# EAGLE design schem2 (EAGLE 7.5.0)
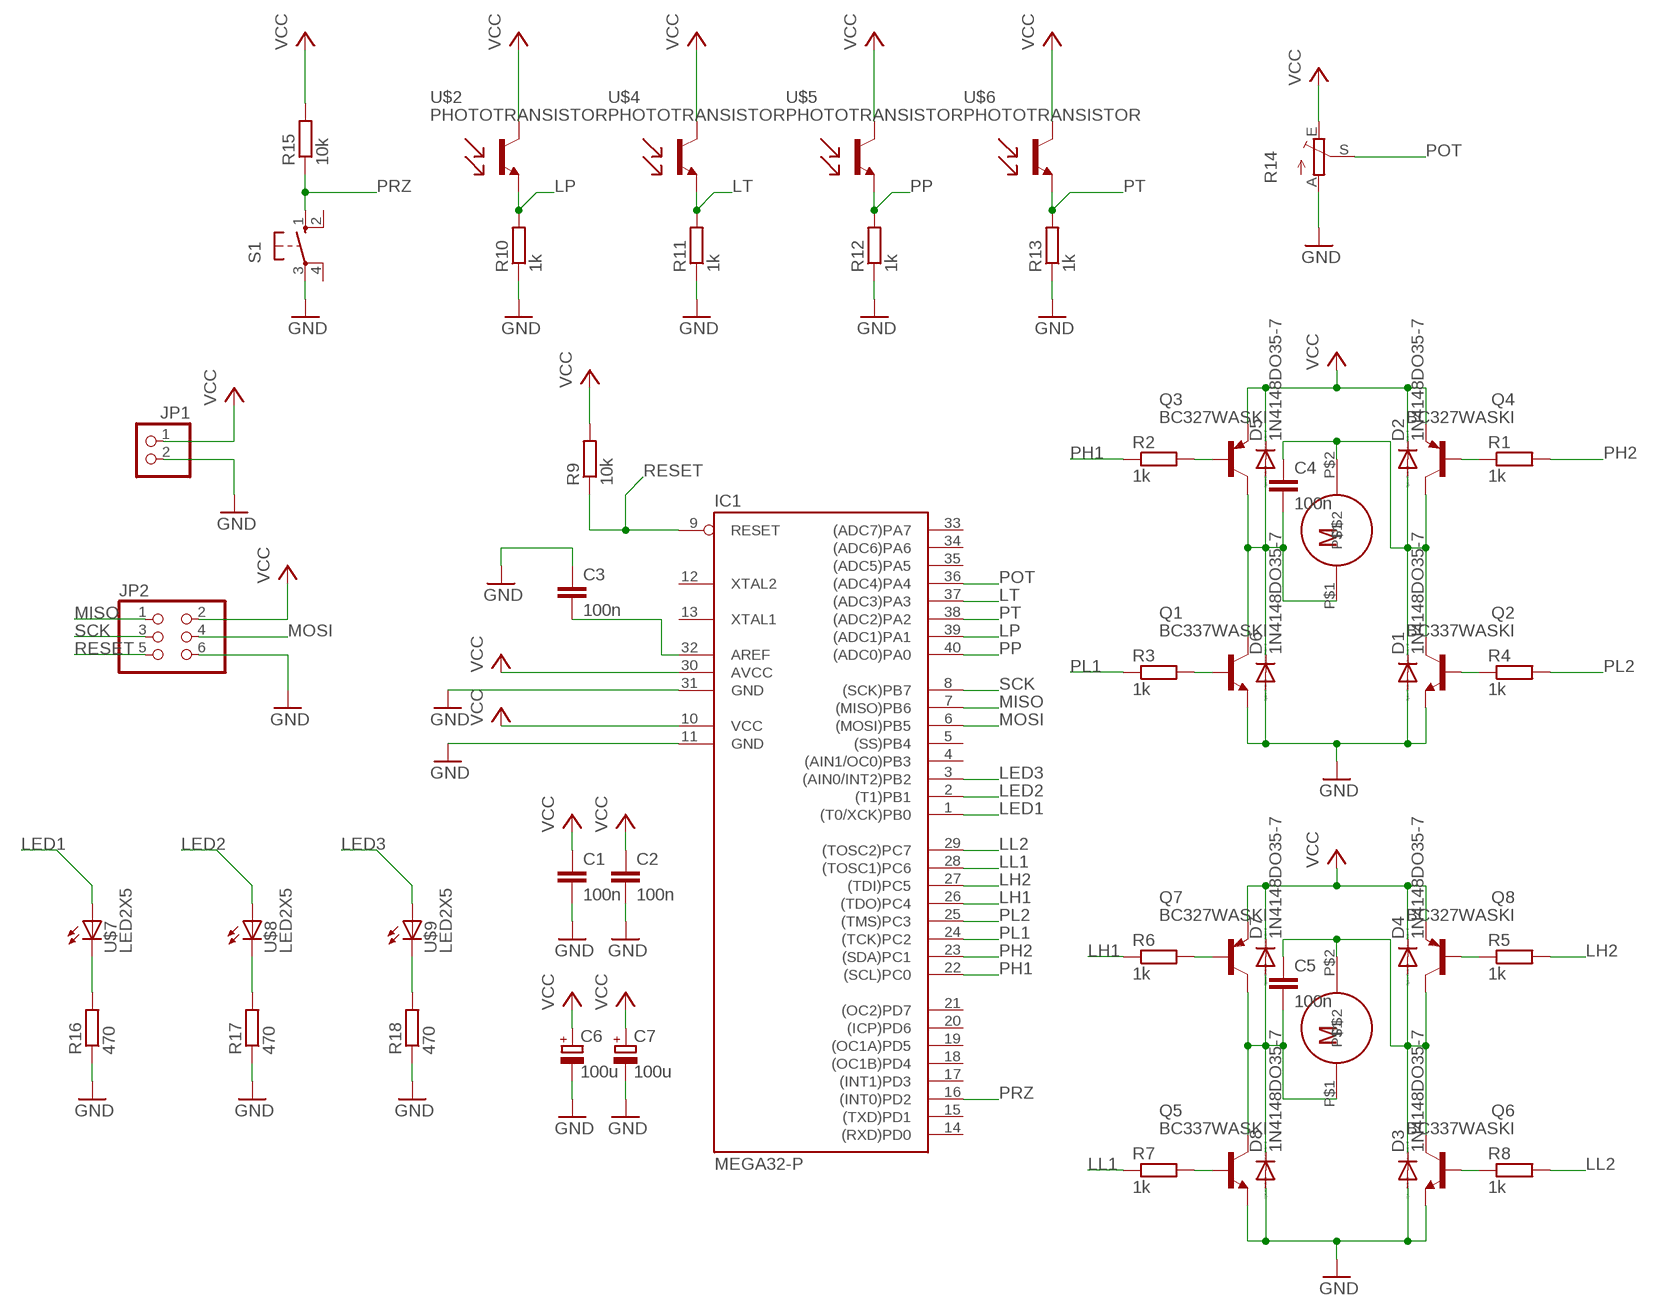
[diagram p0: schematic, sheet 1]

## Parts
C1  100n  C-EU025-025X050  [C025-025X050]
C2  100n  C-EU025-025X050  [C025-025X050]
C3  100n  C-EU025-025X050  [C025-025X050]
C4  100n  C-EU025-025X050  [C025-025X050]
C5  100n  C-EU025-025X050  [C025-025X050]
C6  100u  CPOL-EUE2-5  [E2-5]
C7  100u  CPOL-EUE2-5  [E2-5]
D1  1N4148DO35-7  [DO35-7]
D2  1N4148DO35-7  [DO35-7]
D3  1N4148DO35-7  [DO35-7]
D4  1N4148DO35-7  [DO35-7]
D5  1N4148DO35-7  [DO35-7]
D6  1N4148DO35-7  [DO35-7]
D7  1N4148DO35-7  [DO35-7]
D8  1N4148DO35-7  [DO35-7]
IC1  MEGA32-P  [DIL40]
JP1  PINHD-1X2  [1X02]
JP2  PINHD-2X3  [2X03]
Q1  BC337WASKI  [TO92-WASKI]
Q2  BC337WASKI  [TO92-WASKI]
Q3  BC327WASKI  [TO92-WASKI]
Q4  BC327WASKI  [TO92-WASKI]
Q5  BC337WASKI  [TO92-WASKI]
Q6  BC337WASKI  [TO92-WASKI]
Q7  BC327WASKI  [TO92-WASKI]
Q8  BC327WASKI  [TO92-WASKI]
R1  1k  R-EU_0207/7  [0207/7]
R2  1k  R-EU_0207/7  [0207/7]
R3  1k  R-EU_0207/7  [0207/7]
R4  1k  R-EU_0207/7  [0207/7]
R5  1k  R-EU_0207/7  [0207/7]
R6  1k  R-EU_0207/7  [0207/7]
R7  1k  R-EU_0207/7  [0207/7]
R8  1k  R-EU_0207/7  [0207/7]
R9  10k  R-EU_0207/7  [0207/7]
R10  1k  R-EU_0207/7  [0207/7]
R11  1k  R-EU_0207/7  [0207/7]
R12  1k  R-EU_0207/7  [0207/7]
R13  1k  R-EU_0207/7  [0207/7]
R14  TRIM_EU-B64Y  [B64Y]
R15  10k  R-EU_0207/7  [0207/7]
R16  470  R-EU_0207/7  [0207/7]
R17  470  R-EU_0207/7  [0207/7]
R18  470  R-EU_0207/7  [0207/7]
S1  10-XX  [B3F-10XX]
U$1  DG02S  [DG02S]
U$2  PHOTOTRANSISTOR  [PHOTOTRANSISTOR]
U$3  DG02S  [DG02S]
U$4  PHOTOTRANSISTOR  [PHOTOTRANSISTOR]
U$5  PHOTOTRANSISTOR  [PHOTOTRANSISTOR]
U$6  PHOTOTRANSISTOR  [PHOTOTRANSISTOR]
U$7  LED2X5  [LED3MM]
U$8  LED2X5  [LED3MM]
U$9  LED2X5  [LED3MM]

## Nets
GND: C1.2 C2.2 C3.1 C6.- C7.- D1.A D3.A D6.A D8.A IC1.11(GND) IC1.31(GND) JP1.2 JP2.6 Q1.E Q2.E Q5.E Q6.E R10.1 R11.1 R12.1 R13.1 R14.A R16.1 R17.1 R18.1 S1.3(P)
LED1: IC1.1((T0/XCK)PB0) U$7.A
LED2: IC1.2((T1)PB1) U$8.A
LED3: IC1.3((AIN0/INT2)PB2) U$9.A
LH1: IC1.26((TDO)PC4) R6.1
LH2: IC1.27((TDI)PC5) R5.2
LL1: IC1.28((TOSC1)PC6) R7.1
LL2: IC1.29((TOSC2)PC7) R8.2
LP: IC1.39((ADC1)PA1) R10.2 U$2.E
LT: IC1.37((ADC3)PA3) R11.2 U$4.E
MISO: IC1.7((MISO)PB6) JP2.1
MOSI: IC1.6((MOSI)PB5) JP2.4
N$1: C4.2 D5.A D6.C Q1.C Q3.C U$1.P$1
N$2: C4.1 D1.C D2.A Q2.C Q4.C U$1.P$2
N$3: C5.2 D7.A D8.C Q5.C Q7.C U$3.P$1
N$4: R16.2 U$7.K(C)
N$5: Q7.B R6.2
N$6: Q8.B R5.1
N$7: Q3.B R2.2
N$8: Q4.B R1.1
N$9: Q2.B R4.1
N$10: Q1.B R3.2
N$11: Q6.B R8.1
N$12: Q5.B R7.2
N$13: C5.1 D3.C D4.A Q6.C Q8.C U$3.P$2
N$14: C3.2 IC1.32(AREF)
N$15: R17.2 U$8.K(C)
N$16: R18.2 U$9.K(C)
PH1: IC1.22((SCL)PC0) R2.1
PH2: IC1.23((SDA)PC1) R1.2
PL1: IC1.24((TCK)PC2) R3.1
PL2: IC1.25((TMS)PC3) R4.2
POT: IC1.36((ADC4)PA4) R14.S
PP: IC1.40((ADC0)PA0) R12.2 U$5.E
PRZ: IC1.16((INT0)PD2) R15.1 S1.1(S)
PT: IC1.38((ADC2)PA2) R13.2 U$6.E
RESET: IC1.9(RESET) JP2.5 R9.1
SCK: IC1.8((SCK)PB7) JP2.3
VCC: C1.1 C2.1 C6.+ C7.+ D2.C D4.C D5.C D7.C IC1.10(VCC) IC1.30(AVCC) JP1.1 JP2.2 Q3.E Q4.E Q7.E Q8.E R9.2 R14.E R15.2 U$2.C U$4.C U$5.C U$6.C
Unconnected: IC1.4((AIN1/OC0)PB3) IC1.5((SS)PB4) IC1.12(XTAL2) IC1.13(XTAL1) IC1.14((RXD)PD0) IC1.15((TXD)PD1) IC1.17((INT1)PD3) IC1.18((OC1B)PD4) IC1.19((OC1A)PD5) IC1.20((ICP)PD6) IC1.21((OC2)PD7) IC1.33((ADC7)PA7) IC1.34((ADC6)PA6) IC1.35((ADC5)PA5) S1.2(S1) S1.4(P1)

## Library data of the parts
C1-C5 = BC548:C-EU: CAPACITOR, European symbol
C6 C7 = BC548:CPOL-EU: POLARIZED CAPACITOR, European symbol
D1-D8 = BC548:1N4148: DIODE high speed (Philips)
IC1 = BC548:MEGA32-P: MICROCONTROLLER 32 Kbytes FLASH 2 Kbytes SRAM 1 Kbytes EEPROM USART 8-channel 10 bit ADC Source: www.atmel.com .. doc2503.pdf; MPN: ATMEGA32-16PU; OC_FARNELL: 1661729; OC_NEWARK: 51P1794
JP1 = BC548:PINHD-1X2: PIN HEADER
JP2 = BC548:PINHD-2X3: PIN HEADER
Q1 Q2 Q5 Q6 = BC548:BC337*: NPN Transistor
Q3 Q4 Q7 Q8 = BC548:BC327*: PNP Transistror
R1-R13 R15-R18 = BC548:R-EU_: RESISTOR, European symbol
R14 = BC548:TRIM_EU-: POTENTIOMETER
S1 = BC548:10-XX: OMRON SWITCH; MPN: B3F-1000; OC_FARNELL: 176432; OC_NEWARK: 36M3542
U$1 U$3 = BC548:DG02S
U$2 U$4-U$6 = BC548:PHOTOTRANSISTOR
U$7-U$9 = BC548:LED2X5

## Board
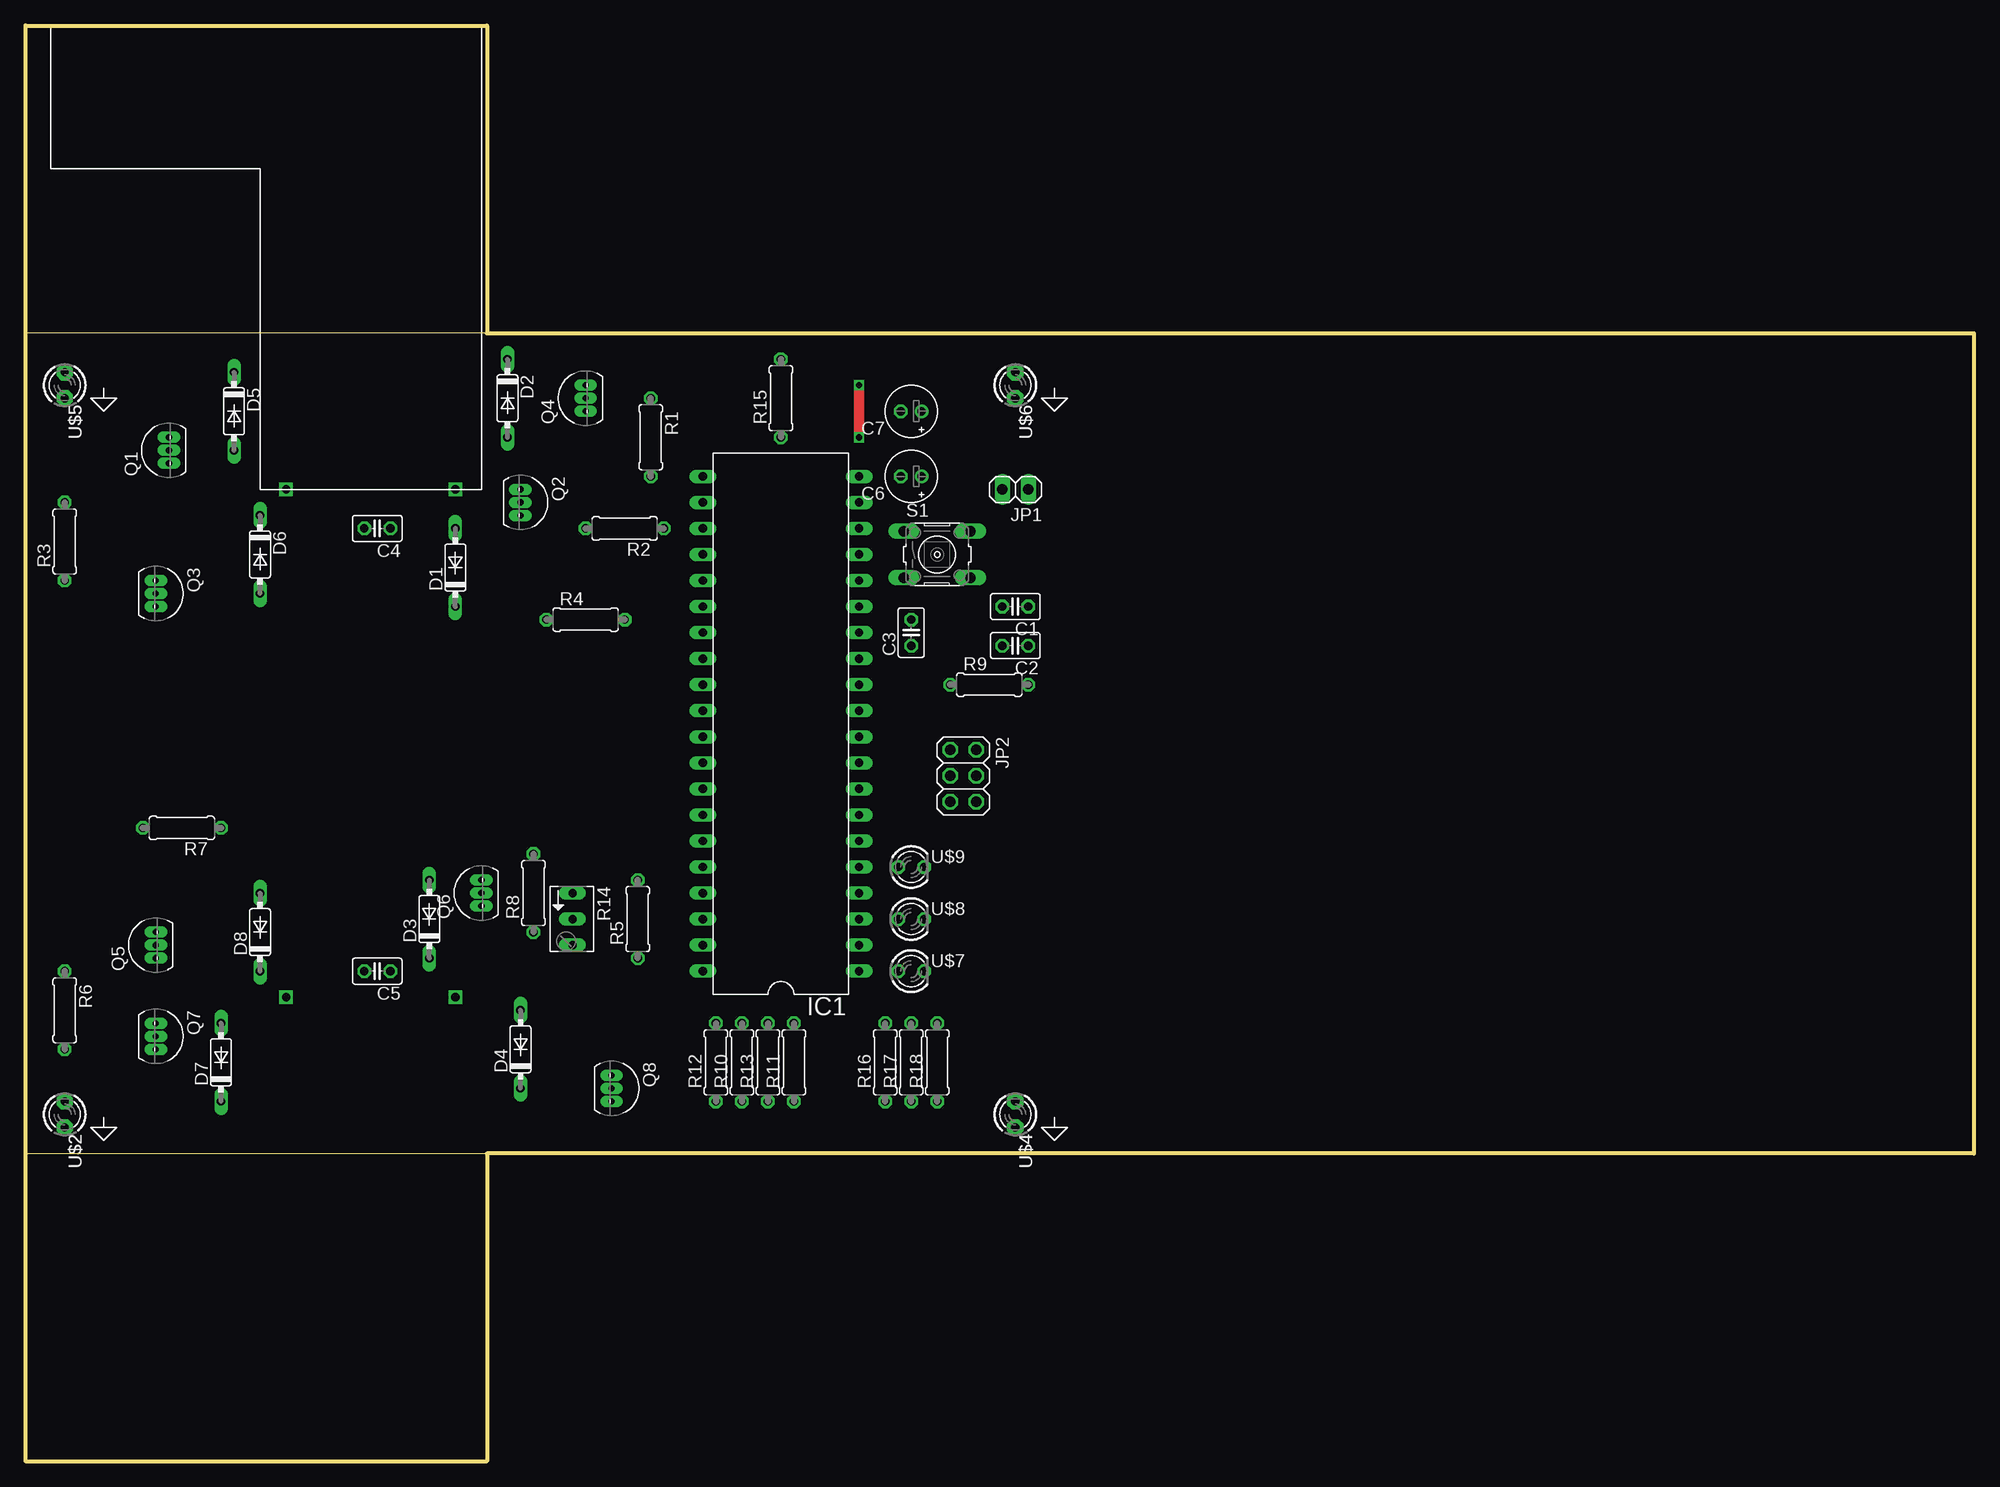
[diagram p1: board, top side]
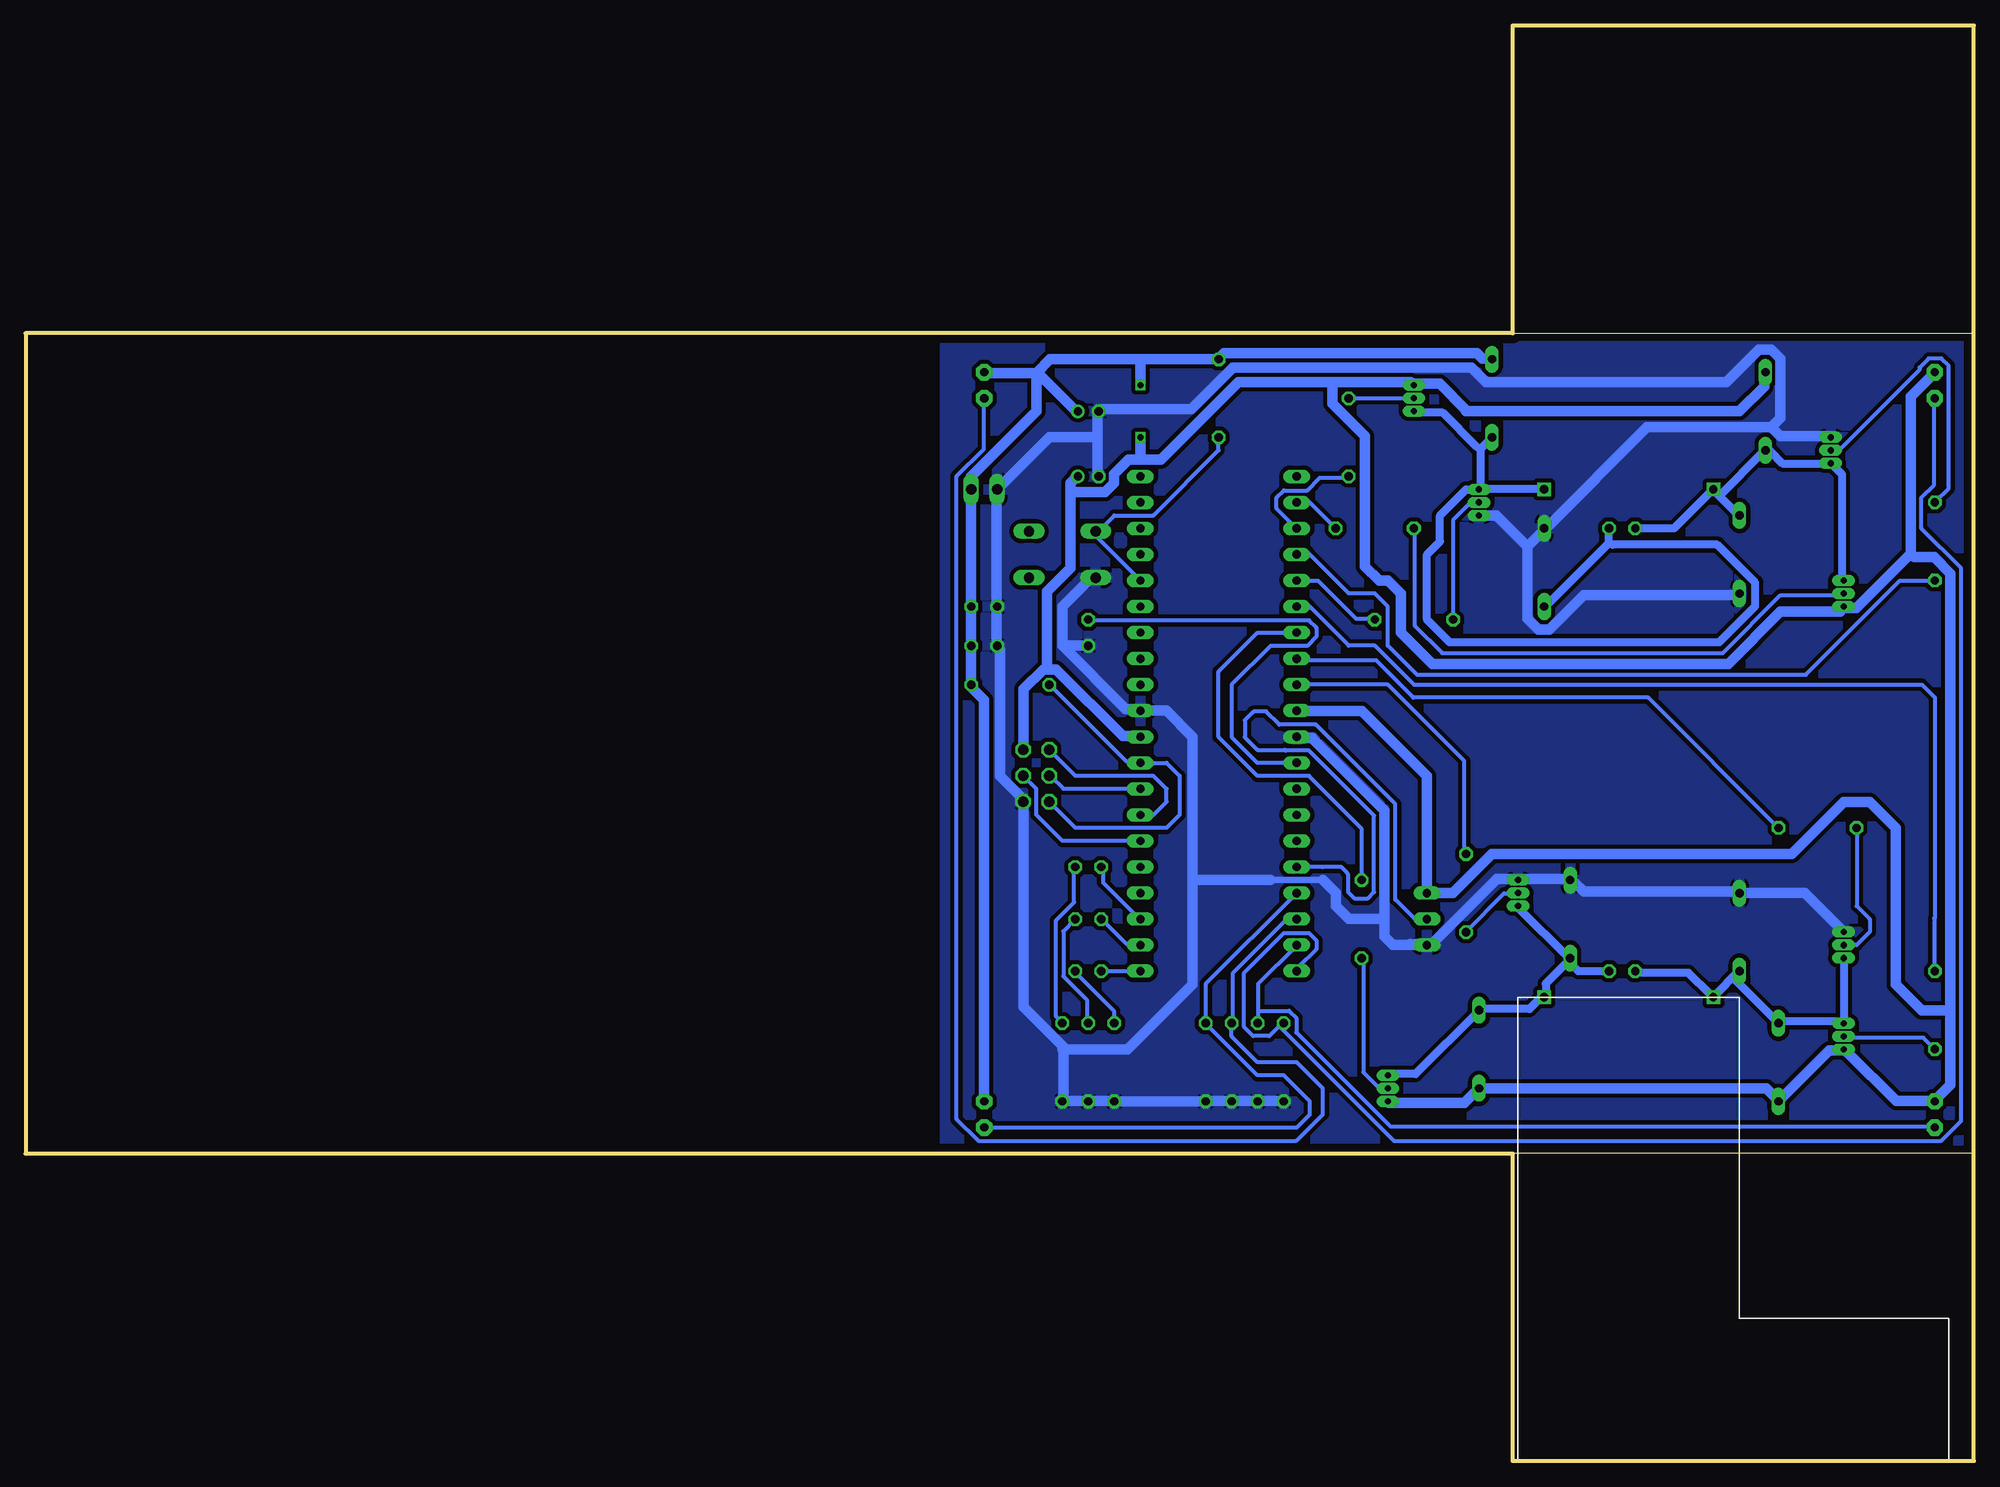
[diagram p2: board, bottom side, seen from below]

Size 190 x 140 mm. Coordinates in mm from the lower left corner, seen from the top.
Outline: 45,30 0,30 0,110 45,110
Outline: 45,30 100,30
Outline: 100,110 45,110
Outline: 45,110 45,140 0,140 0,0 45,0 45,30
Outline: 45,110 190,110 190,30 45,30
Copper layers (1*16): Top 0.035mm / dielectric 1.5mm / Bottom 0.035mm
Design rules "default *": minimum track width 10mil, minimum drill 0.6mm, track to track 12mil, track to pad 12mil, pad to pad 12mil, via to via 12mil, smd to smd 12mil, copper to edge 30mil, drill to drill 8mil, minimum pad ring 10mil, minimum via ring 8mil, stop-mask expansion 4mil, vias tented up to drill 0mil, thermal gap 10mil

### Footprints (pad centres in the part's own frame; a part is rotated, then mirrored left to right if it is on the bottom)
C025-025X050 = drill 0.813 octagon: 1 -1.27,0; 2 1.27,0
E2-5 = drill 0.813 pad 1.27: + -1.016,0 | drill 0.813 pad 1.27 octagon: - 1.016,0
DO35-7 = drill 0.813 long: A 3.81,0; C -3.81,0
DIL40 = drill 0.813 long: 1 -24.13,-7.62; 2 -21.59,-7.62; 3 -19.05,-7.62; 4 -16.51,-7.62; 5 -13.97,-7.62; 6 -11.43,-7.62; 7 -8.89,-7.62; 8 -6.35,-7.62; 9 -3.81,-7.62; 10 -1.27,-7.62; 11 1.27,-7.62; 12 3.81,-7.62; 13 6.35,-7.62; 14 8.89,-7.62; 15 11.43,-7.62; 16 13.97,-7.62; 17 16.51,-7.62; 18 19.05,-7.62; 19 21.59,-7.62; 20 24.13,-7.62; 21 24.13,7.62; 22 21.59,7.62; 23 19.05,7.62; 24 16.51,7.62; 25 13.97,7.62; 26 11.43,7.62; 27 8.89,7.62; 28 6.35,7.62; 29 3.81,7.62; 30 1.27,7.62; 31 -1.27,7.62; 32 -3.81,7.62; 33 -6.35,7.62; 34 -8.89,7.62; 35 -11.43,7.62; 36 -13.97,7.62; 37 -16.51,7.62; 38 -19.05,7.62; 39 -21.59,7.62; 40 -24.13,7.62
1X02 = drill 1.016 long: 1 -1.27,0; 2 1.27,0
2X03 = drill 1.016 octagon: 1 -2.54,-1.27; 2 -2.54,1.27; 3 0,-1.27; 4 0,1.27; 5 2.54,-1.27; 6 2.54,1.27
TO92-WASKI = drill 0.6 long: B 0,0; C -1.27,0; E 1.27,0
0207/7 = drill 0.813 octagon: 1 -3.81,0; 2 3.81,0
B64Y = drill 0.813 long: A 2.54,0; E -2.54,0; S 0,0
B3F-10XX = drill 1.016 long: 1 -3.251,2.261; 2 3.251,2.261; 3 -3.251,-2.261; 4 3.251,-2.261
DG02S = drill 0.8 square: P$1 0,19.05; P$2 0,2.54
PHOTOTRANSISTOR = drill 0.813 pad 1.6 octagon: C -2.54,0; E 0,0
LED3MM = drill 0.813 octagon: A -1.27,0; K 1.27,0

### Placement (x,y rotation side)
C1  96.52,83.34 180 top
C2  96.52,79.53 180 top
C3  86.36,80.8 90 top
C4  34.29,90.96 180 top
C5  34.29,47.78 180 top
C6  86.36,96.04 180 top
C7  86.36,102.39 180 top
D1  41.91,87.15 90 top
D2  46.99,103.66 270 top
D3  39.37,52.86 90 top
D4  48.26,40.16 90 top
D5  20.32,102.39 270 top
D6  22.86,88.42 270 top
D7  19.05,38.89 90 top
D8  22.86,51.59 90 top
IC1  73.66,71.91 90 top
JP1  96.52,94.77 180 top
JP2  91.44,66.83 270 top
Q1  13.97,98.58 90 top
Q2  48.26,93.5 270 top
Q3  12.7,84.61 270 top
Q4  54.61,103.66 90 top
Q5  12.7,50.32 90 top
Q6  44.45,55.4 90 top
Q7  12.7,41.43 270 top
Q8  57.15,36.35 270 top
R1  60.96,99.85 270 top
R2  58.42,90.96 180 top
R3  3.81,89.69 90 top
R4  54.61,82.07 0 top
R5  59.69,52.86 90 top
R6  3.81,43.97 270 top
R7  15.24,61.75 180 top
R8  49.53,55.4 90 top
R9  93.98,75.72 0 top
R10  69.85,38.89 90 top
R11  74.93,38.89 90 top
R12  67.31,38.89 90 top
R13  72.39,38.89 90 top
R14  53.34,52.86 270 top
R15  73.66,103.66 90 top
R16  83.82,38.89 90 top
R17  86.36,38.89 90 top
R18  88.9,38.89 90 top
S1  88.9,88.42 0 top
U$1  44.45,94.77 90 top
U$2  3.81,32.54 270 top
U$3  44.45,45.24 270 bottom
U$4  96.52,32.54 270 top
U$5  3.81,103.66 270 top
U$6  96.52,103.66 270 top
U$7  86.36,47.78 0 top
U$8  86.36,52.86 0 top
U$9  86.36,57.94 0 top

### Tracks (layer width: path | path; a pad name or v marks a point on that pad's centre or on a via)
GND
  Bottom 0.61: 68.58,56.67 63.5,56.67
  Bottom 1: 85.46,99.85 85.46,102.24 C7.- 84.93,102.59 76.3,102.59 72.24,106.65 48.98,106.65 47.57,105.24 24.14,105.24 20.97,108.41 19.73,108.41 18.85,107.53 18.85,101.71 19.73,100.83 | 85.46,99.85 85.46,96.08 C6.- | 19.73,100.83 18.85,99.95 14.1,99.95 Q1.E | 19.73,100.83 31.89,100.83 41.76,90.97 D1.A 42.11,90.61 43.52,89.2 | 43.52,89.2 43.52,82.16 42.46,81.1 41.41,81.1 38.06,84.45 22.91,84.45 D6.A | R12.1 67.48,35.11 69.78,35.11 R10.1 70.3,35.11 72.24,35.11 R13.1 72.77,35.11 74.89,35.11 R11.1 R16.1 83.87,35.11 86.34,35.11 R17.1 86.87,35.11 88.81,35.11 | R14.A 54.45,50.44 52.86,50.44 46.52,56.78 44.93,56.78 Q6.E 44.4,56.78 39.47,56.78 D3.A 38.94,56.43 38.06,55.55 22.91,55.55 D8.A 16.51,55.4 Q5.E | IC1.31 65.9,70.53 64.49,70.53 64.49,70.48 57.47,63.45 57.47,52.86 | 54.97,50.44 R14.A | 81.4,73.34 82.72,73.34 88.9,79.53 | 88.81,35.11 R18.1 88.87,35.11 88.81,35.11 | 88.9,79.53 88.9,83.34 86.36,85.88 85.93,85.88 S1.3 | C3.1 88.9,79.53 | 76.2,56.67 76.2,46.51 82.55,40.16 88.9,40.16 | 88.9,40.16 88.9,40.49 92.68,44.27 92.68,63.83 JP2.6 92.86,64.36 92.86,64.71 94.97,66.83 94.97,79.16 C2.2 95.32,79.69 95.32,83.21 C1.2 95.32,83.74 95.32,94.67 JP1.2 90.17,99.85 85.46,99.85 | 88.81,35.11 88.81,40.06 88.9,40.16 | IC1.11 78.74,73.18 76.2,70.64 76.2,56.67 | Q2.E 46.55,92.23 43.52,89.2 | 57.47,52.86 57.47,51.19 56.63,50.36 54.65,50.36 R14.A | 76.2,56.67 68.58,56.67 | 63.5,56.67 62.23,55.4 62.23,54.13 60.96,52.86 57.47,52.86
  pour Bottom (isolate 0.406): 0,110.01 100.33,110.01 100.33,30 0,30
LED1
  Bottom 0.4: IC1.1 81.4,47.8 84.93,47.8 U$7.A
LED2
  Bottom 0.4: IC1.2 81.4,50.44 82.64,50.44 84.93,52.73 U$8.A
LED3
  Bottom 0.4: IC1.3 81.4,52.91 84.93,56.43 84.93,57.84 U$9.A
LH1
  Bottom 0.4: R6.1 3.88,47.8 3.88,52.93 3.81,52.99 3.81,74.45 5.08,75.72 54.61,75.72 58.42,79.53 60.96,79.53 64.77,83.34 IC1.26 65.9,83.21
LH2
  Bottom 0.4: R5.2 59.73,56.78 59.73,61.72 64.84,66.83 69.85,66.83 73.66,70.64 73.66,76.99 69.85,80.8 67.01,80.8 66.96,80.75 66.08,80.75 IC1.27
LL1
  Bottom 0.4: IC1.28 65.9,78.1 58.32,78.1 54.67,74.45 31.75,74.45 R7.1
LL2
  Bottom 0.4: 65.02,75.64 65.9,75.64 IC1.29 57.15,75.72 49.69,68.26 49.69,59.25 R8.2
LP
  Bottom 0.4: 69.78,43.92 69.78,42.86 R10.2 | 69.78,43.92 69.78,46.56 66.08,50.26 IC1.39 | 69.78,43.92 66.78,43.92 66.08,43.22 66.08,41.8 56.91,32.64 3.88,32.64 U$2.E
LT
  Bottom 0.4: IC1.37 66.08,55.37 74.89,46.56 74.89,42.86 R11.2 | 74.89,42.33 74.89,42.51 R11.2 | U$4.E 66.04,32.54 64.77,33.81 64.77,35.08 67.31,37.62 69.85,37.62 R11.2
MISO
  Bottom 0.4: IC1.7 80.01,63.02 78.74,64.29 78.74,65.56 80.01,66.83 87.63,66.83 JP2.1
MOSI
  Bottom 0.4: IC1.6 88.9,60.48 91.44,63.02 91.44,65.56 JP2.4
N$1
  Bottom 0.8: Q3.C 12.86,86.03 12.86,96.25 13.92,97.31 Q1.C 14.27,97.31 18.68,97.31 19.91,98.54 D5.A 20.44,98.54 24.84,94.14 | 24.84,94.14 22.91,92.2 D6.C | 24.84,94.14 25.37,94.67 U$1.P$1 25.73,94.49 29.25,90.97 32.95,90.97 C4.2
N$2
  Bottom 0.8: 35.59,89.56 35.59,90.79 C4.1 | 35.59,89.56 41.76,83.39 D1.C | 48.1,98.72 48.1,94.84 Q2.C | 48.1,98.72 47.05,99.78 D2.A | Q4.C 54.45,102.24 51.8,102.24 48.45,98.89 48.1,98.72 | U$1.P$2 41.94,94.84 47.75,94.84 Q2.C | 35.59,89.56 35.24,89.38 25.02,89.38 21.32,85.68 21.32,83.39 24.84,79.87 51.13,79.87 53.34,82.07 53.34,88.42 52.07,89.69 52.07,92.23 49.53,94.77 Q2.C
N$3
  Bottom 0.8: Q5.C 12.69,49.03 12.69,42.86 Q7.C 13.04,42.86 19.03,42.86 D7.A 19.38,43.04 23.26,46.91 D8.C 22.91,47.8 25.37,45.33 U$3.P$1 25.73,45.51 27.84,47.62 32.95,47.62 C5.2
N$4
  Bottom 0.4: R16.2 83.87,42.86 83.87,43.92 87.57,47.62 U$7.K
N$5
  Bottom 0.4: Q7.B 12.69,41.28 4.93,41.28 3.88,40.22 R6.2
N$6
  Bottom 0.4: Q8.B 57.27,36.52 58.15,36.52 59.56,37.93 59.56,49.03 R5.1
N$7
  Bottom 0.4: Q3.B 12.86,84.45 18.85,84.45 24.49,78.81 51.85,78.81 54.5,81.46 54.5,90.85 R2.2
N$8
  Bottom 0.4: Q4.B 54.62,103.65 60.79,103.65 R1.1
N$9
  Bottom 0.4: Q2.B 48.28,93.43 49.16,93.43 50.75,91.85 50.75,82.16 R4.1
N$10
  Bottom 0.4: Q1.B 13.92,98.72 13.04,98.72 5.29,106.47 5.29,106.65 4.41,107.53 3.17,107.53 2.47,106.82 2.47,94.84 3.7,93.61 R3.2
N$11
  Bottom 0.4: Q6.B 44.58,55.37 45.81,55.37 49.51,51.67 R8.1
N$12
  Bottom 0.4: R7.2 11.43,54.13 10.16,52.86 10.16,51.59 11.43,50.32 Q5.B
N$13
  Bottom 0.8: Q8.C 57.09,37.75 54.45,37.75 48.28,43.92 D4.A 47.93,44.1 43.34,44.1 42.29,45.15 U$3.P$2 41.76,45.33 41.76,46.56 39.65,48.68 D3.C | Q6.C 44.4,53.96 39.47,49.03 D3.C | C5.1 35.59,47.8 38.59,47.8 39.29,48.5 D3.C
N$14
  Bottom 0.4: C3.2 86.36,81.98 64.84,81.98 64.14,81.27 64.14,80.39 65.02,79.51 68.6,79.51 72.39,75.72 72.39,70.64 69.85,68.1 IC1.32
N$15
  Bottom 0.4: R17.2 86.51,42.86 86.51,44.98 88.81,47.27 88.81,51.67 87.75,52.73 U$8.K
N$16
  Bottom 0.4: U$9.K 87.75,57.84 87.75,54.49 89.51,52.73 89.51,43.39 88.98,42.86 R18.2
PH1
  Bottom 0.4: R2.1 64.77,93.5 IC1.22
PH2
  Bottom 0.4: R1.2 60.97,95.9 63.78,95.9 65.02,94.67 67.31,94.67 68.01,93.96 68.01,92.9 66.08,90.97 IC1.23
PL1
  Bottom 0.4: R3.1 3.88,85.85 7.22,85.85 16.39,76.69 54.31,76.69 57.15,79.53 57.15,83.34 58.42,84.61 60.96,84.61 64.77,88.42 IC1.24 65.9,88.32
PL2
  Bottom 0.4: R4.2 58.5,82.16 60.26,82.16 63.96,85.85 65.9,85.85 IC1.25
POT
  Bottom 0.4: 65.9,57.84 IC1.36 63.5,57.94 63.48,57.92 61.67,57.92 61.19,57.45 61.19,57.38 61.01,57.2 61.01,55.48 60.36,54.84 59.16,54.84 58.5,55.5 58.5,62.95 64.84,69.29 67.13,69.29 67.21,69.37 69.85,69.37 71.12,70.64 71.09,70.66 71.09,72.26 70.32,73.04 70.27,73.04 70.19,73.12 69.03,73.12 67.75,71.84 64.19,71.84 56.43,64.08 56.43,54.76 54.53,52.86 R14.S
PP
  Bottom 0.4: IC1.40 65.9,47.8 65.9,48.15 64.14,49.91 64.14,50.79 64.84,51.5 67.31,51.5 71.19,47.62 71.19,42.33 70.3,41.45 68.72,41.45 67.48,42.69 R12.2 67.66,42.33 56.56,31.23 3.17,31.23 1.23,33.17 1.23,87.09 5.11,90.97 5.11,93.96 3.88,95.19 3.88,103.65 U$5.E
PRZ
  Bottom 0.4: 85.46,90.61 85.46,90.08 81.4,86.03 IC1.16 | 85.46,90.61 S1.1 | 85.46,90.61 85.44,90.61 83.82,92.23 80.01,92.23 73.66,98.58 R15.1
PT
  Bottom 0.4: IC1.38 66.08,52.73 67.13,52.73 72.24,47.62 72.24,42.86 R13.2 | U$6.E 96.56,103.65 96.56,98.72 99.2,96.08 99.2,33.35 97.09,31.23 66.08,31.23 63.5,33.81 63.5,36.35 66.04,38.89 69.85,38.89 72.39,41.43 R13.2 | 72.42,42.51 R13.2
RESET
  Bottom 0.4: R9.1 90.04,75.64 82.64,68.23 81.4,68.23 IC1.9 81.23,68.06 78.78,68.06 78.74,68.1 77.47,66.83 77.47,63.02 78.74,61.75 87.63,61.75 JP2.5 90.04,64.36
SCK
  Bottom 0.4: IC1.8 81.4,65.59 88.81,65.59 90.04,66.83 JP2.3
VCC  (via drill 0.6)
  Top 1: v81.28,104.93 v81.28,99.85
  Bottom 1: 6.17,88.5 11.45,83.21 12.69,83.21 Q3.E 13.04,82.86 18.85,82.86 23.96,77.75 52.83,77.75 55.88,80.8 55.88,84.61 57.15,85.88 57.99,85.88 59.38,87.27 59.38,99.95 62.55,103.12 62.55,105.24 | 6.17,88.5 6.17,103.83 3.88,106.12 U$5.C | Q8.E 57.09,34.93 49.69,34.93 48.28,36.34 D4.C 47.75,36.34 20.26,36.34 19.38,35.46 D7.C 19.03,35.11 14.1,40.04 12.86,40.04 Q7.E 12.33,39.87 7.58,35.11 3.88,35.11 U$2.C 3.52,35.46 2.29,36.7 2.29,43.97 | 2.29,43.97 2.29,86.56 3.88,88.15 5.82,88.15 6.17,88.5 | U$4.C 96.56,35.11 96.56,74.23 97.61,75.28 R9.2 97.79,75.81 97.79,79.51 C2.1 97.79,79.87 97.79,83.21 C1.1 97.79,83.74 97.79,94.67 JP1.1 97.79,96.04 91.44,102.39 91.44,106.12 | D5.C 20.44,106.12 20.44,104.81 22.86,102.39 49.53,102.39 49.53,102.52 52.07,105.06 54.45,105.06 Q4.E 54.97,105.24 62.55,105.24 | D2.C 47.05,107.53 47.93,107.53 48.45,108.06 73.12,108.06 73.65,107.53 R15.2 | 90.39,77.22 90.74,77.22 92.68,75.28 92.68,69.47 JP2.2 | 90.39,77.22 89.51,77.22 82.99,70.7 81.4,70.7 IC1.10 | 87.39,96.08 C6.+ 87.75,95.72 88.1,95.37 88.1,94.49 | 87.39,102.24 C7.+ 87.75,102.59 91.27,106.12 91.44,106.12 | 91.44,106.12 96.38,106.12 U$6.C | 90.39,77.22 90.39,84.8 88.1,87.09 88.1,94.49 | 62.55,105.24 71.71,105.24 79.29,97.66 81.28,97.66 | 81.28,97.66 82.46,97.66 83.87,96.25 83.87,95.37 84.75,94.49 88.1,94.49 | 66.02,73.2 IC1.30 65.9,73.17 59.68,73.17 53.34,66.83 R14.E 50.8,55.4 46.99,59.21 17.78,59.21 12.7,64.29 10.16,64.29 7.62,61.75 7.62,46.51 5.08,43.97 2.29,43.97 | R15.2 90.09,107.47 91.44,106.12 | R15.2 81.28,107.47 v81.28,104.93 | v81.28,99.85 81.28,97.66